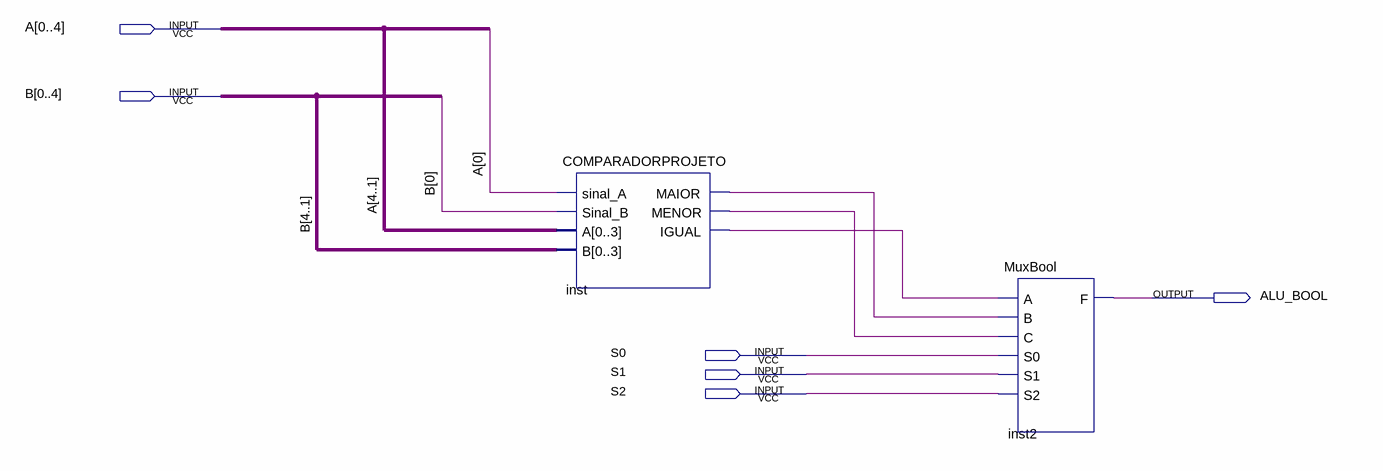
[diagram p0: schematic sheet]
// Quartus schematic ALU_BOOL.bdf as structural Verilog: 2 symbols, 6 pins
module ALU_BOOL (
  input  [0:4] A,
  input  [0:4] B,
  input  S0,
  input  S1,
  input  S2,
  output ALU_BOOL
);

  wire inst_igual, inst_maior, inst_menor;

  COMPARADORPROJETO inst (
    .sinal_A(A[0]), .Sinal_B(B[0]), .A({A[4], A[3], A[2], A[1]}), .B({B[4], B[3], B[2], B[1]}),
    .MAIOR(inst_maior), .MENOR(inst_menor), .IGUAL(inst_igual));
  MuxBool inst2 (.A(inst_igual), .B(inst_maior), .C(inst_menor), .S0(S0), .S1(S1), .S2(S2), .F(ALU_BOOL));
endmodule
